# Altium schematic sheet Overcurrent_Protection.SchDoc: Overcurrent Protection
size A3; DocumentNumber: 8; SheetNumber: 8; SheetTotal: 20
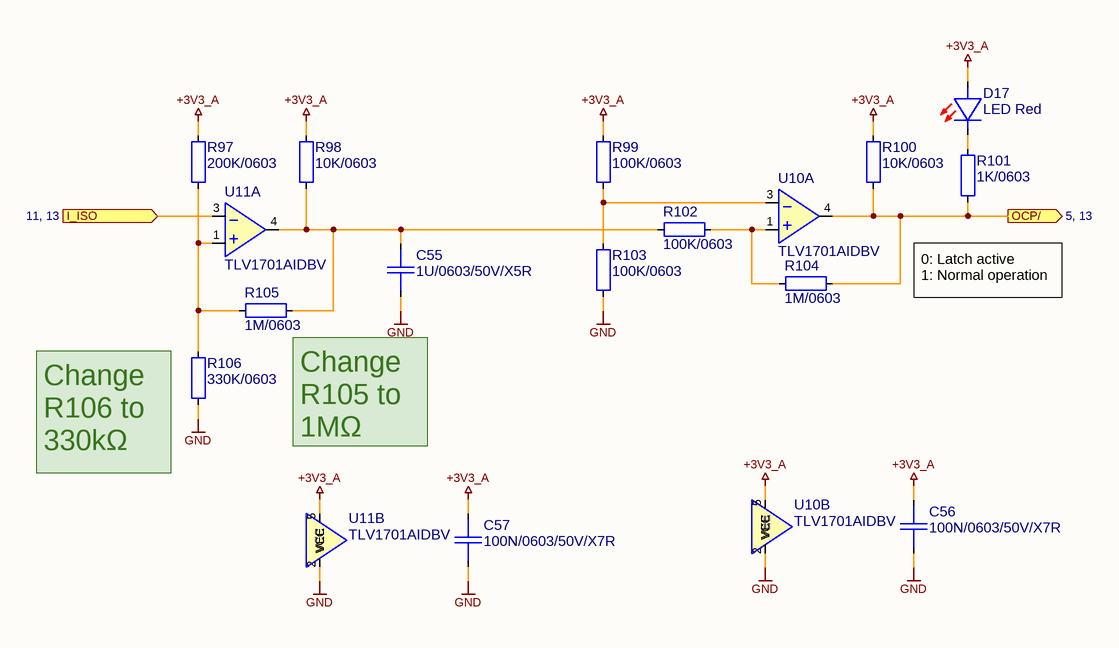
[diagram p0: Overcurrent_Protection.SchDoc]

## Parts
C55  1U/0603/50V/X5R  [CAP0603_X7R]
C56  100N/0603/50V/X7R  [CAP0603_X7R]
C57  100N/0603/50V/X7R  [CAP0603_X7R]
D17  LED Red  [LED0805_RED]
R97  200K/0603  [R0603-0.40-WW]
R98  10K/0603  [R0603-0.40-WW]
R99  100K/0603  [R0603-0.40-WW]
R100  10K/0603  [R0603-0.40-WW]
R101  1K/0603  [R0603-0.40-WW]
R102  100K/0603  [R0603-0.40-WW]
R103  100K/0603  [R0603-0.40-WW]
R104  1M/0603  [R0603-0.40-WW]
R105  1M/0603  [R0603-0.40-WW]
R106  330K/0603  [R0603-0.40-WW]
U10  TLV1701AIDBV  [SOT2395P280X125-5-NW]  (parts A,B of 2)
U11  TLV1701AIDBV  [SOT2395P280X125-5-NW]  (parts A,B of 2)

## Ports
I_ISO (in, see 11, 13), OCP/ (out, see 5, 13)

## Nets
+3V3_A: C56.1 C57.1 D17.2(A) R97.1 R98.2 R99.2 R100.2 U10.5(VCC) U11.5(VCC)
GND: C55.2 C56.2 C57.2 R103.2 R106.2 U10.2(VEE) U11.2(VEE)
I_ISO: U11.3(IN-) ; port I_ISO
OCP/: R100.1 R101.1 R104.2 U10.4(OUT) ; port OCP/
NetC55_1: C55.1 R98.1 R102.1 R105.2 U11.4(OUT)
NetD17_1: D17.1(C) R101.2
NetR97_2: R97.2 R105.1 R106.1 U11.1(IN+)
NetR99_1: R99.1 R103.1 U10.3(IN-)
NetR102_2: R102.2 R104.1 U10.1(IN+)

## Notes on the sheet
- 0: Latch active
  1: Normal operation
- (near R105) Change R105 to 1MΩ
- (near R106) Change R106 to 330kΩ
- Date:
- Size:
- A3
- Schema:
- Layout:

## Library data of the parts
C55 = 1U/0603/50V/X5R: CAP SM 0603 1.0uF 50V X5R; Manufacturer: GENERIC; Manufacturer 1: Samsung Electro-Mechanics; Manufacturer Part Number 1: CL10A105KB8NNNC; Absolute Value: 1E-6; Eurocircuits GPN: GPC0603105-X5R; Part Number: 1U/0603/50V/X5R; Package: 0603; Value: 1.0uF; HelpURL: https://mm.digikey.com/Volume0/opasdata/d220001/medias/docus/658/CL10A105KB8NNNC_Spec.pdf; Supplier 1: Digi-Key; Supplier Part Number 1: 1276-1860-1-ND; Manufacturer Part Number 3: CL10A105KB8NNNC; Supplier 3: LCSC; Supplier Part Number 3: C15849; JLC Type: Basic
C56 C57 = 100N/0603/50V/X7R: CAP SM 0603 100nF 50V X7R; Manufacturer: GENERIC; Manufacturer 1: YAGEO; Manufacturer Part Number 1: CC0603KPX7R9BB104; Absolute Value: 1E-7; Eurocircuits GPN: GPC0603104; Part Number: 100N/0603/50V/X7R; Package: 0603; Value: 100nF; HelpURL: https://www.yageo.com/upload/media/product/app/datasheet/mlcc/upy-gphc_x7r_6_3v-to-250v.pdf; Supplier 1: Digi-Key; Supplier Part Number 1: 311-3567-1-ND; Supplier 3: LCSC; Supplier Part Number 3: C14663; Manufacturer 2: YAGEO; Manufacturer Part Number 2: CC0603MRX7R9BB104; Supplier 2: Digi-Key; Supplier Part Number 2: 311-4110-1-ND; JLC Type: Basic; Manufacturer Part Number 3: CC0603KRX7R9BB104
D17 = LED Red 0805: Generic LED Red 0805; Manufacturer 1: Würth; Manufacturer Part Number 1: 150080RS75000; Part Number: LED Red 0805; Manufacturer: GENERIC; Package: 805; Value: Red; Absolute Value: Red; HelpURL: https://www.we-online.com/katalog/datasheet/150060RS75000.pdf; Supplier 1: Digikey; Supplier Part Number 1: 732-4984-1-ND; Manufacturer 3: Foshan NationStar Optoelectronics; Manufacturer Part Number 3: NCD0805R1; Supplier 3: LCSC; Supplier Part Number 3: C84256; JLC Type: Basic
R97 = 200K/0603: RES SM 0603 200K; Manufacturer: GENERIC; Manufacturer 1: YAGEO; Manufacturer Part Number 1: RC0603FR-13200KL; Absolute Value: 200000; Eurocircuits GPN: GPR0603200K; Part Number: 200K/0603; Package: 0603; Value: 200K; HelpURL: https://www.yageogroup.com/content/datasheet/asset/file/PYU-RC_GROUP_51_ROHS_L; Supplier 1: Digi-Key; Supplier Part Number 1: 13-RC0603FR-13200KLCT-ND; Manufacturer 2: YAGEO; Manufacturer Part Number 2: RC0603FR-10200KL; Supplier 2: Digi-Key; Supplier Part Number 2: 13-RC0603FR-10200KLCT-ND; Manufacturer 3: UNI-ROYAL(Uniroyal Elec); Manufacturer Part Number 3: 0603WAF2003T5E; Supplier 3: LCSC; Supplier Part Number 3: C25811; JLC Type: Basic
R98 R100 = 10K/0603: RES SM 0603 10K; Manufacturer: GENERIC; Manufacturer 1: YAGEO; Manufacturer Part Number 1: RC0603FR-1310KL; Absolute Value: 10000; Eurocircuits GPN: GPR060310K; Part Number: 10K/0603; Package: 0603; Value: 10K; HelpURL: https://www.yageogroup.com/content/datasheet/asset/file/PYU-RC_GROUP_51_ROHS_L; Supplier 1: Digi-Key; Supplier Part Number 1: 13-RC0603FR-1310KLCT-ND; Manufacturer 2: YAGEO; Manufacturer Part Number 2: RC0603FR-1010KL; Supplier 2: Digi-Key; Supplier Part Number 2: 13-RC0603FR-1010KLCT-ND; Manufacturer 3: UNI-ROYAL(Uniroyal Elec); Manufacturer Part Number 3: 0603WAF1002T5E; Supplier 3: LCSC; Supplier Part Number 3: C25804; JLC Type: Basic
R99 R102 R103 = 100K/0603: RES SM 0603 100K; Manufacturer: GENERIC; Manufacturer 1: YAGEO; Manufacturer Part Number 1: RC0603FR-13100KL; Absolute Value: 100000; Eurocircuits GPN: GPR0603100K; Part Number: 100K/0603; Package: 0603; Value: 100K; HelpURL: https://www.yageogroup.com/content/datasheet/asset/file/PYU-RC_GROUP_51_ROHS_L; Supplier 1: Digi-Key; Supplier Part Number 1: 13-RC0603FR-13100KLCT-ND; Manufacturer 2: YAGEO; Manufacturer Part Number 2: RC0603FR-10100KL; Supplier 2: Digi-Key; Supplier Part Number 2: 13-RC0603FR-10100KLCT-ND; Manufacturer 3: UNI-ROYAL(Uniroyal Elec); Manufacturer Part Number 3: 0603WAF1003T5E; Supplier 3: LCSC; Supplier Part Number 3: C25803; JLC Type: Basic
R101 = 1K/0603: RES SM 0603 1K; Manufacturer: GENERIC; Manufacturer 1: YAGEO; Manufacturer Part Number 1: RC0603FR-131KL; Absolute Value: 1000; Eurocircuits GPN: GPR06031K; Part Number: 1K/0603; Package: 0603; Value: 1K; HelpURL: https://www.yageogroup.com/content/datasheet/asset/file/PYU-RC_GROUP_51_ROHS_L; Supplier 1: Digi-Key; Supplier Part Number 1: 13-RC0603FR-131KLCT-ND; Manufacturer 2: YAGEO; Manufacturer Part Number 2: RC0603FR-101KL; Supplier 2: Digi-Key; Supplier Part Number 2: 13-RC0603FR-101KLCT-ND; Manufacturer 3: UNI-ROYAL(Uniroyal Elec); Manufacturer Part Number 3: 0603WAF1001T5E; Supplier 3: LCSC; Supplier Part Number 3: C21190; JLC Type: Basic
R104 R105 = 1M/0603: RES SM 0603 1M; Manufacturer: GENERIC; Manufacturer 1: YAGEO; Manufacturer Part Number 1: RC0603FR-131ML; Absolute Value: 1000000; Eurocircuits GPN: GPR06031M; Part Number: 1M/0603; Package: 0603; Value: 1M; HelpURL: https://www.yageogroup.com/content/datasheet/asset/file/PYU-RC_GROUP_51_ROHS_L; Supplier 1: Digi-Key; Supplier Part Number 1: 13-RC0603FR-131MLCT-ND; Manufacturer 2: YAGEO; Manufacturer Part Number 2: RC0603FR-101ML; Supplier 2: Digi-Key; Supplier Part Number 2: 13-RC0603FR-101MLCT-ND; Manufacturer 3: UNI-ROYAL(Uniroyal Elec); Manufacturer Part Number 3: 0603WAF1004T5E; Supplier 3: LCSC; Supplier Part Number 3: C22935; JLC Type: Basic
R106 = 330K/0603: RES SM 0603 330K; Manufacturer: GENERIC; Manufacturer 1: YAGEO; Manufacturer Part Number 1: RC0603FR-13330KL; Absolute Value: 330000; Eurocircuits GPN: GPR0603330K; Part Number: 330K/0603; Package: 0603; Value: 330K; HelpURL: https://www.yageogroup.com/content/datasheet/asset/file/PYU-RC_GROUP_51_ROHS_L; Supplier 1: Digi-Key; Supplier Part Number 1: 13-RC0603FR-13330KLCT-ND; Manufacturer 2: YAGEO; Manufacturer Part Number 2: RC0603FR-10330KL; Supplier 2: Digi-Key; Supplier Part Number 2: 13-RC0603FR-10330KLCT-ND; Manufacturer 3: YAGEO; Manufacturer Part Number 3: RC0603FR-07330KL; Supplier 3: LCSC; Supplier Part Number 3: C114618; JLC Type: Basic
U10 U11 = TLV1701 SOT23: TLV1701 2.2-V to 36-V, microPower Comparato; Manufacturer: Texas Instruments; Manufacturer Part Number 1: TLV1701AIDBVR; Part Number: TLV1701 SOT23; Package: SOT23-5; HelpURL: https://www.ti.com/lit/ds/symlink/tlv1701.pdf; Manufacturer 1: Texas Instruments; Supplier 1: Digi-Key; Supplier Part Number 1: 296-40599-1-ND; Manufacturer 2: Texas Instruments; Manufacturer Part Number 2: TLV1701QDBVRQ1; Supplier 2: Digi-Key; Supplier Part Number 2: 296-47458-1-ND; Manufacturer 3: Texas Instruments; Manufacturer Part Number 3: TLV1701AIDBVR; Supplier 3: LCSC; Supplier Part Number 3: C130035